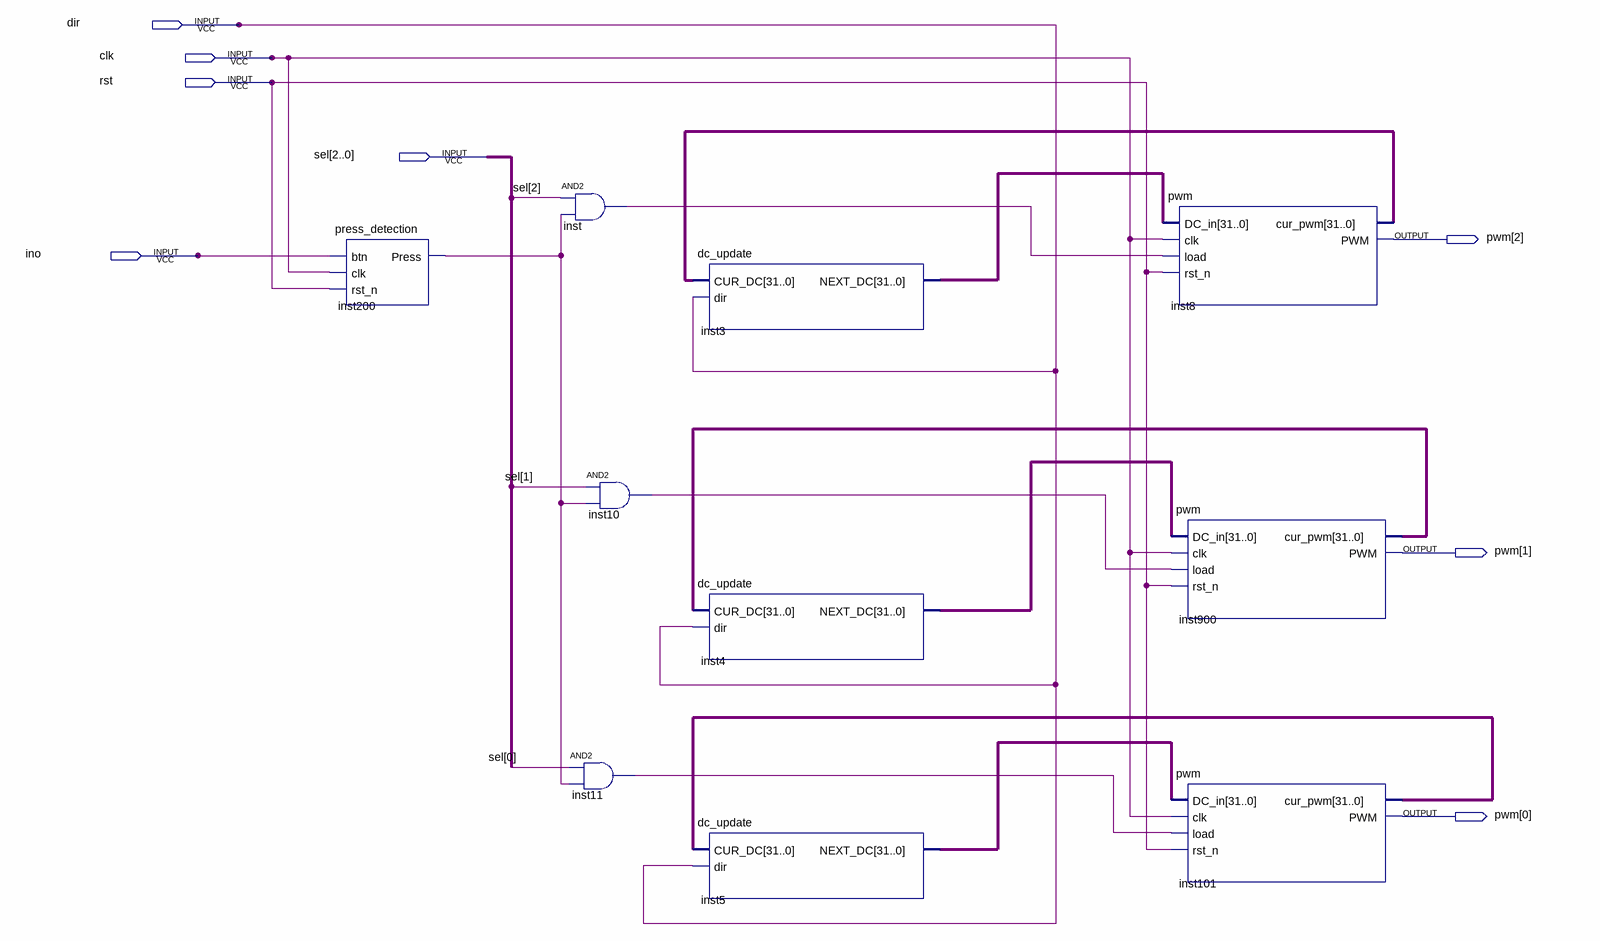
[diagram p0: schematic sheet]
// Quartus schematic SpiderOneLeg.bdf as structural Verilog: 10 symbols, 8 pins
module SpiderOneLeg (
  input  dir,
  input  clk,
  input  rst,
  input  [2:0] sel,
  input  ino,
  output [2:0] pwm
);

  wire inst10_out, inst11_out, inst200_press, inst_out;
  wire [31:0] inst3_next_dc, inst4_next_dc, inst5_next_dc, inst8_cur_pwm, inst101_cur_pwm, inst900_cur_pwm;

  press_detection inst200 (.btn(ino), .clk(clk), .rst_n(rst), .Press(inst200_press));
  and inst (inst_out, sel[2], inst200_press);
  and inst10 (inst10_out, sel[1], inst200_press);
  and inst11 (inst11_out, sel[0], inst200_press);
  dc_update inst3 (.CUR_DC(inst8_cur_pwm), .dir(dir), .NEXT_DC(inst3_next_dc));
  dc_update inst4 (.CUR_DC(inst900_cur_pwm), .dir(dir), .NEXT_DC(inst4_next_dc));
  dc_update inst5 (.CUR_DC(inst101_cur_pwm), .dir(dir), .NEXT_DC(inst5_next_dc));
  pwm inst8 (.DC_in(inst3_next_dc), .clk(clk), .load(inst_out), .rst_n(rst), .cur_pwm(inst8_cur_pwm), .PWM(pwm[2]));
  pwm inst900 (
    .DC_in(inst4_next_dc), .clk(clk), .load(inst10_out), .rst_n(rst), .cur_pwm(inst900_cur_pwm), .PWM(pwm[1]));
  pwm inst101 (
    .DC_in(inst5_next_dc), .clk(clk), .load(inst11_out), .rst_n(rst), .cur_pwm(inst101_cur_pwm), .PWM(pwm[0]));
endmodule
